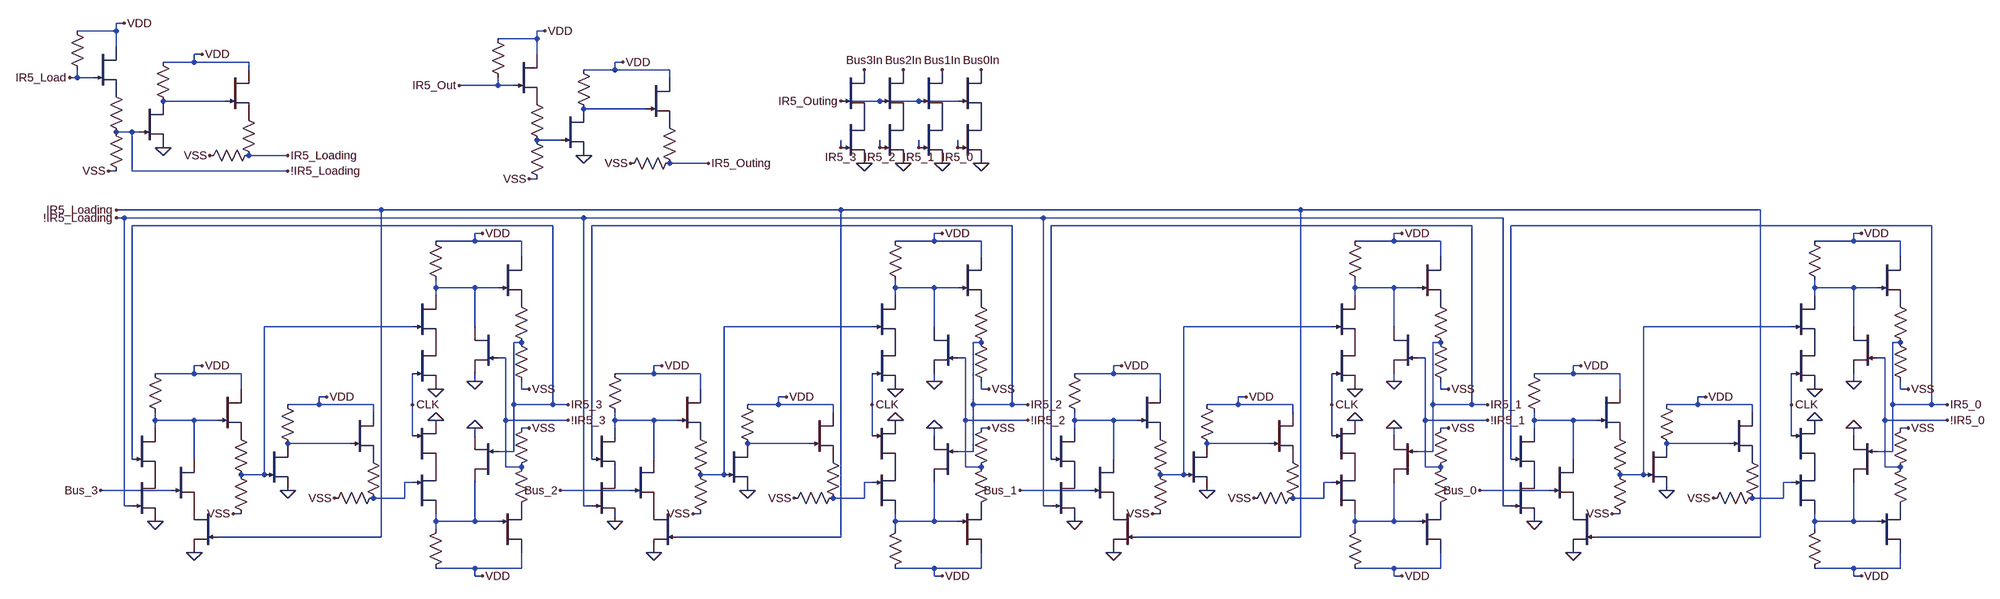
[diagram p0: schematic rv32i_ir5.asc]
rv32i_ir5.asc, the LTspice schematic file:
Version 4.1
SHEET 1 109444 42780
WIRE -5680 -1200 -5696 -1200
WIRE -5696 -1184 -5696 -1200
WIRE -5696 -1184 -5776 -1184
WIRE -4816 -1184 -4832 -1184
WIRE -4832 -1168 -4832 -1184
WIRE -4832 -1168 -4912 -1168
WIRE -5696 -1152 -5696 -1184
WIRE -5520 -1136 -5536 -1136
WIRE -4832 -1136 -4832 -1168
WIRE -5536 -1120 -5536 -1136
WIRE -5536 -1120 -5600 -1120
WIRE -5424 -1120 -5536 -1120
WIRE -4656 -1120 -4672 -1120
WIRE -5424 -1104 -5424 -1120
WIRE -4672 -1104 -4672 -1120
WIRE -4672 -1104 -4736 -1104
WIRE -4560 -1104 -4672 -1104
WIRE -5776 -1088 -5776 -1104
WIRE -5776 -1088 -5792 -1088
WIRE -5744 -1088 -5776 -1088
WIRE -4560 -1088 -4560 -1104
WIRE -4912 -1072 -4912 -1088
WIRE -4912 -1072 -4992 -1072
WIRE -4880 -1072 -4912 -1072
WIRE -5472 -1040 -5600 -1040
WIRE -4608 -1024 -4736 -1024
WIRE -5664 -976 -5696 -976
WIRE -5648 -976 -5664 -976
WIRE -4784 -960 -4832 -960
WIRE -5344 -928 -5424 -928
WIRE -4480 -912 -4560 -912
WIRE -5696 -896 -5712 -896
WIRE -5664 -896 -5664 -976
WIRE -5344 -896 -5664 -896
WIRE -4832 -880 -4848 -880
WIRE -5152 -816 -5696 -816
WIRE -5680 -800 -5696 -800
WIRE -4800 -784 -5664 -784
WIRE -4944 -768 -4960 -768
WIRE -4960 -752 -4960 -768
WIRE -4960 -752 -5040 -752
WIRE -4864 -752 -4960 -752
WIRE -4864 -720 -4864 -752
WIRE -5040 -656 -5040 -672
WIRE -4960 -656 -5040 -656
WIRE -4912 -656 -4960 -656
WIRE -5040 -640 -5040 -656
WIRE -5088 -576 -5392 -576
WIRE -4960 -576 -4960 -656
WIRE -4864 -544 -4880 -544
WIRE -4896 -512 -4912 -512
WIRE -5520 -496 -5536 -496
WIRE -5536 -480 -5536 -496
WIRE -5536 -480 -5616 -480
WIRE -5440 -480 -5536 -480
WIRE -4960 -464 -4960 -480
WIRE -5440 -448 -5440 -480
WIRE -4864 -448 -4864 -464
WIRE -4848 -448 -4864 -448
WIRE -5264 -432 -5280 -432
WIRE -5280 -416 -5280 -432
WIRE -5280 -416 -5344 -416
WIRE -5168 -416 -5280 -416
WIRE -5088 -416 -5088 -480
WIRE -4880 -416 -4880 -544
WIRE -4800 -416 -4800 -784
WIRE -4800 -416 -4880 -416
WIRE -4768 -416 -4800 -416
WIRE -5168 -400 -5168 -416
WIRE -5616 -384 -5616 -400
WIRE -5536 -384 -5616 -384
WIRE -5488 -384 -5536 -384
WIRE -4896 -384 -4896 -512
WIRE -4768 -384 -4896 -384
WIRE -5616 -368 -5616 -384
WIRE -4848 -368 -4864 -368
WIRE -5088 -352 -5088 -416
WIRE -4960 -352 -4960 -368
WIRE -5216 -336 -5344 -336
WIRE -4880 -320 -4880 -416
WIRE -4880 -320 -4912 -320
WIRE -5664 -304 -5664 -784
WIRE -5536 -304 -5536 -384
WIRE -4896 -288 -4896 -384
WIRE -4864 -288 -4896 -288
WIRE -5392 -272 -5392 -576
WIRE -5392 -272 -5440 -272
WIRE -5088 -256 -5104 -256
WIRE -5584 -240 -5728 -240
WIRE -5104 -224 -5104 -256
WIRE -5104 -224 -5168 -224
WIRE -5680 -208 -5680 -800
WIRE -5664 -208 -5680 -208
WIRE -5440 -192 -5456 -192
WIRE -5040 -176 -5040 -192
WIRE -4960 -176 -4960 -256
WIRE -4960 -176 -5040 -176
WIRE -4912 -176 -4960 -176
WIRE -5040 -160 -5040 -176
WIRE -5152 -144 -5152 -816
WIRE -5152 -144 -5488 -144
WIRE -4960 -80 -5040 -80
WIRE -4864 -80 -4864 -112
WIRE -4864 -80 -4960 -80
WIRE -4960 -64 -4960 -80
WIRE -4944 -64 -4960 -64
FLAG -5600 -944 0
FLAG -5680 -1200 VDD
FLAG -5520 -1136 VDD
FLAG -5712 -896 VSS
FLAG -5504 -928 VSS
FLAG -4736 -928 0
FLAG -4816 -1184 VDD
FLAG -4656 -1120 VDD
FLAG -4848 -880 VSS
FLAG -4640 -912 VSS
FLAG -4944 -768 VDD
FLAG -4944 -64 VDD
FLAG -4848 -368 VSS
FLAG -5040 -384 0
FLAG -5040 -448 0
FLAG -4960 -464 0
FLAG -4960 -368 0
FLAG -4848 -448 VSS
FLAG -5088 -416 CLK
FLAG -5536 -112 0
FLAG -5616 -176 0
FLAG -5344 -240 0
FLAG -5520 -496 VDD
FLAG -5264 -432 VDD
FLAG -5456 -192 VSS
FLAG -5248 -224 VSS
FLAG -5728 -240 Bus_3
FLAG -5696 -816 IR5_Loading
FLAG -5344 -928 IR5_Loading
FLAG -5344 -896 !IR5_Loading
FLAG -5696 -800 !IR5_Loading
FLAG -5792 -1088 IR5_Load
FLAG -4992 -1072 IR5_Out
FLAG -4480 -912 IR5_Outing
FLAG -4768 -384 !IR5_3
FLAG -4768 -416 IR5_3
SYMBOL res -5792 -1200 R0
WINDOW 0 -35 57 Invisible 2
WINDOW 3 34 56 Invisible 2
SYMATTR InstName R1
SYMATTR Value 100k
SYMBOL njf -5744 -1152 R0
WINDOW 0 56 32 Invisible 2
WINDOW 3 56 72 Invisible 2
SYMATTR InstName J_F1
SYMATTR Value DR
SYMBOL res -5712 -1072 R0
WINDOW 0 -24 60 Invisible 2
WINDOW 3 34 58 Invisible 2
SYMATTR InstName R2
SYMATTR Value 1k
SYMBOL res -5712 -992 R0
WINDOW 0 -22 62 Invisible 2
WINDOW 3 37 62 Invisible 2
SYMATTR InstName R3
SYMATTR Value 4.8k
SYMBOL njf -5648 -1040 R0
WINDOW 0 56 32 Invisible 2
WINDOW 3 56 72 Invisible 2
SYMATTR InstName J_A1
SYMATTR Value DR
SYMBOL res -5616 -1136 R0
WINDOW 0 56 32 Invisible 2
WINDOW 3 56 72 Invisible 2
SYMATTR InstName R4
SYMATTR Value 50k
SYMBOL njf -5472 -1104 R0
WINDOW 0 56 32 Invisible 2
WINDOW 3 56 72 Invisible 2
SYMATTR InstName J_A2
SYMATTR Value DR
SYMBOL res -5440 -1024 R0
WINDOW 0 37 24 Invisible 2
WINDOW 3 -30 25 Invisible 2
SYMATTR InstName R5
SYMATTR Value 1k
SYMBOL res -5408 -944 R90
WINDOW 0 59 66 Invisible 2
WINDOW 3 34 13 Invisible 2
SYMATTR InstName R6
SYMATTR Value 4.5k
SYMBOL res -4928 -1184 R0
WINDOW 0 -35 57 Invisible 2
WINDOW 3 34 56 Invisible 2
SYMATTR InstName R7
SYMATTR Value 100k
SYMBOL njf -4880 -1136 R0
WINDOW 0 56 32 Invisible 2
WINDOW 3 56 72 Invisible 2
SYMATTR InstName J_F2
SYMATTR Value DR
SYMBOL res -4848 -1056 R0
WINDOW 0 -24 60 Invisible 2
WINDOW 3 34 58 Invisible 2
SYMATTR InstName R8
SYMATTR Value 1k
SYMBOL res -4848 -976 R0
WINDOW 0 -22 62 Invisible 2
WINDOW 3 37 62 Invisible 2
SYMATTR InstName R9
SYMATTR Value 4.8k
SYMBOL njf -4784 -1024 R0
WINDOW 0 56 32 Invisible 2
WINDOW 3 56 72 Invisible 2
SYMATTR InstName J_A3
SYMATTR Value DR
SYMBOL res -4752 -1120 R0
WINDOW 0 56 32 Invisible 2
WINDOW 3 56 72 Invisible 2
SYMATTR InstName R10
SYMATTR Value 50k
SYMBOL njf -4608 -1088 R0
WINDOW 0 56 32 Invisible 2
WINDOW 3 56 72 Invisible 2
SYMATTR InstName J_A4
SYMATTR Value DR
SYMBOL res -4576 -1008 R0
WINDOW 0 37 24 Invisible 2
WINDOW 3 -30 25 Invisible 2
SYMATTR InstName R11
SYMATTR Value 1k
SYMBOL res -4544 -928 R90
WINDOW 0 59 66 Invisible 2
WINDOW 3 34 13 Invisible 2
SYMATTR InstName R12
SYMATTR Value 4.5k
SYMBOL njf -5088 -640 R0
WINDOW 0 56 32 Invisible 2
WINDOW 3 56 72 Invisible 2
SYMATTR InstName J_A5
SYMATTR Value DR
SYMBOL res -5056 -768 R0
WINDOW 0 -35 57 Invisible 2
WINDOW 3 34 56 Invisible 2
SYMATTR InstName R13
SYMATTR Value 100k
SYMBOL njf -4912 -720 R0
WINDOW 0 56 32 Invisible 2
WINDOW 3 56 72 Invisible 2
SYMATTR InstName J_F3
SYMATTR Value DR
SYMBOL res -4880 -640 R0
WINDOW 0 -24 60 Invisible 2
WINDOW 3 34 58 Invisible 2
SYMATTR InstName R14
SYMATTR Value 1k
SYMBOL res -4880 -560 R0
WINDOW 0 -22 62 Invisible 2
WINDOW 3 37 62 Invisible 2
SYMATTR InstName R15
SYMATTR Value 4.8k
SYMBOL njf -4912 -576 M0
WINDOW 0 11 -7 Invisible 2
WINDOW 3 56 72 Invisible 2
SYMATTR InstName J_B1
SYMATTR Value DR
SYMBOL njf -5088 -192 M180
WINDOW 0 56 32 Invisible 2
WINDOW 3 56 72 Invisible 2
SYMATTR InstName J_A6
SYMATTR Value DR
SYMBOL res -5056 -64 M180
WINDOW 0 36 76 Invisible 2
WINDOW 3 36 40 Invisible 2
SYMATTR InstName R16
SYMATTR Value 100k
SYMBOL njf -4912 -112 M180
WINDOW 0 56 32 Invisible 2
WINDOW 3 56 72 Invisible 2
SYMATTR InstName J_F4
SYMATTR Value DR
SYMBOL res -4880 -192 M180
WINDOW 0 36 76 Invisible 2
WINDOW 3 36 40 Invisible 2
SYMATTR InstName R17
SYMATTR Value 1k
SYMBOL res -4880 -272 M180
WINDOW 0 36 76 Invisible 2
WINDOW 3 36 40 Invisible 2
SYMATTR InstName R18
SYMATTR Value 4.8k
SYMBOL njf -4912 -256 R180
WINDOW 0 56 32 Invisible 2
WINDOW 3 56 72 Invisible 2
SYMATTR InstName J_B2
SYMATTR Value DR
SYMBOL njf -5088 -544 R0
WINDOW 0 56 32 Invisible 2
WINDOW 3 56 72 Invisible 2
SYMATTR InstName J_A7
SYMATTR Value DR
SYMBOL njf -5088 -288 M180
WINDOW 0 56 32 Invisible 2
WINDOW 3 56 72 Invisible 2
SYMATTR InstName J_A8
SYMATTR Value DR
SYMBOL njf -5664 -368 R0
WINDOW 0 56 32 Invisible 2
WINDOW 3 56 72 Invisible 2
SYMATTR InstName J_A9
SYMATTR Value DR
SYMBOL res -5632 -496 R0
WINDOW 0 -35 57 Invisible 2
WINDOW 3 34 56 Invisible 2
SYMATTR InstName R19
SYMATTR Value 100k
SYMBOL njf -5488 -448 R0
WINDOW 0 56 32 Invisible 2
WINDOW 3 56 72 Invisible 2
SYMATTR InstName J_F5
SYMATTR Value DR
SYMBOL res -5456 -368 R0
WINDOW 0 -24 60 Invisible 2
WINDOW 3 34 58 Invisible 2
SYMATTR InstName R20
SYMATTR Value 1k
SYMBOL res -5456 -288 R0
WINDOW 0 -22 62 Invisible 2
WINDOW 3 37 62 Invisible 2
SYMATTR InstName R21
SYMATTR Value 4.8k
SYMBOL njf -5584 -304 R0
WINDOW 0 56 32 Invisible 2
WINDOW 3 56 72 Invisible 2
SYMATTR InstName J_B3
SYMATTR Value DR
SYMBOL njf -5392 -336 R0
WINDOW 0 56 32 Invisible 2
WINDOW 3 56 72 Invisible 2
SYMATTR InstName J_A10
SYMATTR Value DR
SYMBOL res -5360 -432 R0
WINDOW 0 56 32 Invisible 2
WINDOW 3 56 72 Invisible 2
SYMATTR InstName R22
SYMATTR Value 50k
SYMBOL njf -5216 -400 R0
WINDOW 0 56 32 Invisible 2
WINDOW 3 56 72 Invisible 2
SYMATTR InstName J_A11
SYMATTR Value DR
SYMBOL res -5184 -320 R0
WINDOW 0 37 24 Invisible 2
WINDOW 3 -30 25 Invisible 2
SYMATTR InstName R23
SYMATTR Value 1k
SYMBOL res -5152 -240 R90
WINDOW 0 59 66 Invisible 2
WINDOW 3 34 13 Invisible 2
SYMATTR InstName R24
SYMATTR Value 4.5k
SYMBOL njf -5664 -272 R0
WINDOW 0 56 32 Invisible 2
WINDOW 3 56 72 Invisible 2
SYMATTR InstName J_A12
SYMATTR Value DR
SYMBOL njf -5488 -208 M0
WINDOW 0 56 32 Invisible 2
WINDOW 3 56 72 Invisible 2
SYMATTR InstName J_B4
SYMATTR Value DR
WIRE -4208 -816 -5152 -816
WIRE -4736 -800 -5680 -800
WIRE -3856 -784 -4720 -784
WIRE -4000 -768 -4016 -768
WIRE -4016 -752 -4016 -768
WIRE -4016 -752 -4096 -752
WIRE -3920 -752 -4016 -752
WIRE -3920 -720 -3920 -752
WIRE -4096 -656 -4096 -672
WIRE -4016 -656 -4096 -656
WIRE -3968 -656 -4016 -656
WIRE -4096 -640 -4096 -656
WIRE -4144 -576 -4448 -576
WIRE -4016 -576 -4016 -656
WIRE -3920 -544 -3936 -544
WIRE -3952 -512 -3968 -512
WIRE -4576 -496 -4592 -496
WIRE -4592 -480 -4592 -496
WIRE -4592 -480 -4672 -480
WIRE -4496 -480 -4592 -480
WIRE -4016 -464 -4016 -480
WIRE -4496 -448 -4496 -480
WIRE -3920 -448 -3920 -464
WIRE -3904 -448 -3920 -448
WIRE -4320 -432 -4336 -432
WIRE -4336 -416 -4336 -432
WIRE -4336 -416 -4400 -416
WIRE -4224 -416 -4336 -416
WIRE -4144 -416 -4144 -480
WIRE -3936 -416 -3936 -544
WIRE -3856 -416 -3856 -784
WIRE -3856 -416 -3936 -416
WIRE -3824 -416 -3856 -416
WIRE -4224 -400 -4224 -416
WIRE -4672 -384 -4672 -400
WIRE -4592 -384 -4672 -384
WIRE -4544 -384 -4592 -384
WIRE -3952 -384 -3952 -512
WIRE -3824 -384 -3952 -384
WIRE -4672 -368 -4672 -384
WIRE -3904 -368 -3920 -368
WIRE -4144 -352 -4144 -416
WIRE -4016 -352 -4016 -368
WIRE -4272 -336 -4400 -336
WIRE -3936 -320 -3936 -416
WIRE -3936 -320 -3968 -320
WIRE -4720 -304 -4720 -784
WIRE -4592 -304 -4592 -384
WIRE -3952 -288 -3952 -384
WIRE -3920 -288 -3952 -288
WIRE -4448 -272 -4448 -576
WIRE -4448 -272 -4496 -272
WIRE -4144 -256 -4160 -256
WIRE -4640 -240 -4784 -240
WIRE -4160 -224 -4160 -256
WIRE -4160 -224 -4224 -224
WIRE -4736 -208 -4736 -800
WIRE -4720 -208 -4736 -208
WIRE -4496 -192 -4512 -192
WIRE -4096 -176 -4096 -192
WIRE -4016 -176 -4016 -256
WIRE -4016 -176 -4096 -176
WIRE -3968 -176 -4016 -176
WIRE -4096 -160 -4096 -176
WIRE -4208 -144 -4208 -816
WIRE -4208 -144 -4544 -144
WIRE -4016 -80 -4096 -80
WIRE -3920 -80 -3920 -112
WIRE -3920 -80 -4016 -80
WIRE -4016 -64 -4016 -80
WIRE -4000 -64 -4016 -64
FLAG -4000 -768 VDD
FLAG -4000 -64 VDD
FLAG -3904 -368 VSS
FLAG -4096 -384 0
FLAG -4096 -448 0
FLAG -4016 -464 0
FLAG -4016 -368 0
FLAG -3904 -448 VSS
FLAG -4144 -416 CLK
FLAG -4592 -112 0
FLAG -4672 -176 0
FLAG -4400 -240 0
FLAG -4576 -496 VDD
FLAG -4320 -432 VDD
FLAG -4512 -192 VSS
FLAG -4304 -224 VSS
FLAG -4784 -240 Bus_2
FLAG -3824 -416 IR5_2
FLAG -3824 -384 !IR5_2
SYMBOL njf -4144 -640 R0
WINDOW 0 56 32 Invisible 2
WINDOW 3 56 72 Invisible 2
SYMATTR InstName J_A13
SYMATTR Value DR
SYMBOL res -4112 -768 R0
WINDOW 0 -35 57 Invisible 2
WINDOW 3 34 56 Invisible 2
SYMATTR InstName R25
SYMATTR Value 100k
SYMBOL njf -3968 -720 R0
WINDOW 0 56 32 Invisible 2
WINDOW 3 56 72 Invisible 2
SYMATTR InstName J_F6
SYMATTR Value DR
SYMBOL res -3936 -640 R0
WINDOW 0 -24 60 Invisible 2
WINDOW 3 34 58 Invisible 2
SYMATTR InstName R26
SYMATTR Value 1k
SYMBOL res -3936 -560 R0
WINDOW 0 -22 62 Invisible 2
WINDOW 3 37 62 Invisible 2
SYMATTR InstName R27
SYMATTR Value 4.8k
SYMBOL njf -3968 -576 M0
WINDOW 0 11 -7 Invisible 2
WINDOW 3 56 72 Invisible 2
SYMATTR InstName J_B5
SYMATTR Value DR
SYMBOL njf -4144 -192 M180
WINDOW 0 56 32 Invisible 2
WINDOW 3 56 72 Invisible 2
SYMATTR InstName J_A14
SYMATTR Value DR
SYMBOL res -4112 -64 M180
WINDOW 0 36 76 Invisible 2
WINDOW 3 36 40 Invisible 2
SYMATTR InstName R28
SYMATTR Value 100k
SYMBOL njf -3968 -112 M180
WINDOW 0 56 32 Invisible 2
WINDOW 3 56 72 Invisible 2
SYMATTR InstName J_F7
SYMATTR Value DR
SYMBOL res -3936 -192 M180
WINDOW 0 36 76 Invisible 2
WINDOW 3 36 40 Invisible 2
SYMATTR InstName R29
SYMATTR Value 1k
SYMBOL res -3936 -272 M180
WINDOW 0 36 76 Invisible 2
WINDOW 3 36 40 Invisible 2
SYMATTR InstName R30
SYMATTR Value 4.8k
SYMBOL njf -3968 -256 R180
WINDOW 0 56 32 Invisible 2
WINDOW 3 56 72 Invisible 2
SYMATTR InstName J_B6
SYMATTR Value DR
SYMBOL njf -4144 -544 R0
WINDOW 0 56 32 Invisible 2
WINDOW 3 56 72 Invisible 2
SYMATTR InstName J_A15
SYMATTR Value DR
SYMBOL njf -4144 -288 M180
WINDOW 0 56 32 Invisible 2
WINDOW 3 56 72 Invisible 2
SYMATTR InstName J_A16
SYMATTR Value DR
SYMBOL njf -4720 -368 R0
WINDOW 0 56 32 Invisible 2
WINDOW 3 56 72 Invisible 2
SYMATTR InstName J_A17
SYMATTR Value DR
SYMBOL res -4688 -496 R0
WINDOW 0 -35 57 Invisible 2
WINDOW 3 34 56 Invisible 2
SYMATTR InstName R31
SYMATTR Value 100k
SYMBOL njf -4544 -448 R0
WINDOW 0 56 32 Invisible 2
WINDOW 3 56 72 Invisible 2
SYMATTR InstName J_F8
SYMATTR Value DR
SYMBOL res -4512 -368 R0
WINDOW 0 -24 60 Invisible 2
WINDOW 3 34 58 Invisible 2
SYMATTR InstName R32
SYMATTR Value 1k
SYMBOL res -4512 -288 R0
WINDOW 0 -22 62 Invisible 2
WINDOW 3 37 62 Invisible 2
SYMATTR InstName R33
SYMATTR Value 4.8k
SYMBOL njf -4640 -304 R0
WINDOW 0 56 32 Invisible 2
WINDOW 3 56 72 Invisible 2
SYMATTR InstName J_B7
SYMATTR Value DR
SYMBOL njf -4448 -336 R0
WINDOW 0 56 32 Invisible 2
WINDOW 3 56 72 Invisible 2
SYMATTR InstName J_A18
SYMATTR Value DR
SYMBOL res -4416 -432 R0
WINDOW 0 56 32 Invisible 2
WINDOW 3 56 72 Invisible 2
SYMATTR InstName R34
SYMATTR Value 50k
SYMBOL njf -4272 -400 R0
WINDOW 0 56 32 Invisible 2
WINDOW 3 56 72 Invisible 2
SYMATTR InstName J_A19
SYMATTR Value DR
SYMBOL res -4240 -320 R0
WINDOW 0 37 24 Invisible 2
WINDOW 3 -30 25 Invisible 2
SYMATTR InstName R35
SYMATTR Value 1k
SYMBOL res -4208 -240 R90
WINDOW 0 59 66 Invisible 2
WINDOW 3 34 13 Invisible 2
SYMATTR InstName R36
SYMATTR Value 4.5k
SYMBOL njf -4720 -272 R0
WINDOW 0 56 32 Invisible 2
WINDOW 3 56 72 Invisible 2
SYMATTR InstName J_A20
SYMATTR Value DR
SYMBOL njf -4544 -208 M0
WINDOW 0 56 32 Invisible 2
WINDOW 3 56 72 Invisible 2
SYMATTR InstName J_B8
SYMATTR Value DR
WIRE -3264 -816 -4208 -816
WIRE -3792 -800 -4736 -800
WIRE -2912 -784 -3776 -784
WIRE -3056 -768 -3072 -768
WIRE -3072 -752 -3072 -768
WIRE -3072 -752 -3152 -752
WIRE -2976 -752 -3072 -752
WIRE -2976 -720 -2976 -752
WIRE -3152 -656 -3152 -672
WIRE -3072 -656 -3152 -656
WIRE -3024 -656 -3072 -656
WIRE -3152 -640 -3152 -656
WIRE -3200 -576 -3504 -576
WIRE -3072 -576 -3072 -656
WIRE -2976 -544 -2992 -544
WIRE -3008 -512 -3024 -512
WIRE -3632 -496 -3648 -496
WIRE -3648 -480 -3648 -496
WIRE -3648 -480 -3728 -480
WIRE -3552 -480 -3648 -480
WIRE -3072 -464 -3072 -480
WIRE -3552 -448 -3552 -480
WIRE -2976 -448 -2976 -464
WIRE -2960 -448 -2976 -448
WIRE -3376 -432 -3392 -432
WIRE -3392 -416 -3392 -432
WIRE -3392 -416 -3456 -416
WIRE -3280 -416 -3392 -416
WIRE -3200 -416 -3200 -480
WIRE -2992 -416 -2992 -544
WIRE -2912 -416 -2912 -784
WIRE -2912 -416 -2992 -416
WIRE -2880 -416 -2912 -416
WIRE -3280 -400 -3280 -416
WIRE -3728 -384 -3728 -400
WIRE -3648 -384 -3728 -384
WIRE -3600 -384 -3648 -384
WIRE -3008 -384 -3008 -512
WIRE -2880 -384 -3008 -384
WIRE -3728 -368 -3728 -384
WIRE -2960 -368 -2976 -368
WIRE -3200 -352 -3200 -416
WIRE -3072 -352 -3072 -368
WIRE -3328 -336 -3456 -336
WIRE -2992 -320 -2992 -416
WIRE -2992 -320 -3024 -320
WIRE -3776 -304 -3776 -784
WIRE -3648 -304 -3648 -384
WIRE -3008 -288 -3008 -384
WIRE -2976 -288 -3008 -288
WIRE -3504 -272 -3504 -576
WIRE -3504 -272 -3552 -272
WIRE -3200 -256 -3216 -256
WIRE -3696 -240 -3840 -240
WIRE -3216 -224 -3216 -256
WIRE -3216 -224 -3280 -224
WIRE -3792 -208 -3792 -800
WIRE -3776 -208 -3792 -208
WIRE -3552 -192 -3568 -192
WIRE -3152 -176 -3152 -192
WIRE -3072 -176 -3072 -256
WIRE -3072 -176 -3152 -176
WIRE -3024 -176 -3072 -176
WIRE -3152 -160 -3152 -176
WIRE -3264 -144 -3264 -816
WIRE -3264 -144 -3600 -144
WIRE -3072 -80 -3152 -80
WIRE -2976 -80 -2976 -112
WIRE -2976 -80 -3072 -80
WIRE -3072 -64 -3072 -80
WIRE -3056 -64 -3072 -64
FLAG -3056 -768 VDD
FLAG -3056 -64 VDD
FLAG -2960 -368 VSS
FLAG -3152 -384 0
FLAG -3152 -448 0
FLAG -3072 -464 0
FLAG -3072 -368 0
FLAG -2960 -448 VSS
FLAG -3200 -416 CLK
FLAG -3648 -112 0
FLAG -3728 -176 0
FLAG -3456 -240 0
FLAG -3632 -496 VDD
FLAG -3376 -432 VDD
FLAG -3568 -192 VSS
FLAG -3360 -224 VSS
FLAG -3840 -240 Bus_1
FLAG -2880 -416 IR5_1
FLAG -2880 -384 !IR5_1
SYMBOL njf -3200 -640 R0
WINDOW 0 56 32 Invisible 2
WINDOW 3 56 72 Invisible 2
SYMATTR InstName J_A21
SYMATTR Value DR
SYMBOL res -3168 -768 R0
WINDOW 0 -35 57 Invisible 2
WINDOW 3 34 56 Invisible 2
SYMATTR InstName R37
SYMATTR Value 100k
SYMBOL njf -3024 -720 R0
WINDOW 0 56 32 Invisible 2
WINDOW 3 56 72 Invisible 2
SYMATTR InstName J_F9
SYMATTR Value DR
SYMBOL res -2992 -640 R0
WINDOW 0 -24 60 Invisible 2
WINDOW 3 34 58 Invisible 2
SYMATTR InstName R38
SYMATTR Value 1k
SYMBOL res -2992 -560 R0
WINDOW 0 -22 62 Invisible 2
WINDOW 3 37 62 Invisible 2
SYMATTR InstName R39
SYMATTR Value 4.8k
SYMBOL njf -3024 -576 M0
WINDOW 0 11 -7 Invisible 2
WINDOW 3 56 72 Invisible 2
SYMATTR InstName J_B9
SYMATTR Value DR
SYMBOL njf -3200 -192 M180
WINDOW 0 56 32 Invisible 2
WINDOW 3 56 72 Invisible 2
SYMATTR InstName J_A22
SYMATTR Value DR
SYMBOL res -3168 -64 M180
WINDOW 0 36 76 Invisible 2
WINDOW 3 36 40 Invisible 2
SYMATTR InstName R40
SYMATTR Value 100k
SYMBOL njf -3024 -112 M180
WINDOW 0 56 32 Invisible 2
WINDOW 3 56 72 Invisible 2
SYMATTR InstName J_F10
SYMATTR Value DR
SYMBOL res -2992 -192 M180
WINDOW 0 36 76 Invisible 2
WINDOW 3 36 40 Invisible 2
SYMATTR InstName R41
SYMATTR Value 1k
SYMBOL res -2992 -272 M180
WINDOW 0 36 76 Invisible 2
WINDOW 3 36 40 Invisible 2
SYMATTR InstName R42
SYMATTR Value 4.8k
SYMBOL njf -3024 -256 R180
WINDOW 0 56 32 Invisible 2
WINDOW 3 56 72 Invisible 2
SYMATTR InstName J_B10
SYMATTR Value DR
SYMBOL njf -3200 -544 R0
WINDOW 0 56 32 Invisible 2
WINDOW 3 56 72 Invisible 2
SYMATTR InstName J_A23
SYMATTR Value DR
SYMBOL njf -3200 -288 M180
WINDOW 0 56 32 Invisible 2
WINDOW 3 56 72 Invisible 2
SYMATTR InstName J_A24
SYMATTR Value DR
SYMBOL njf -3776 -368 R0
WINDOW 0 56 32 Invisible 2
WINDOW 3 56 72 Invisible 2
SYMATTR InstName J_A25
SYMATTR Value DR
SYMBOL res -3744 -496 R0
WINDOW 0 -35 57 Invisible 2
WINDOW 3 34 56 Invisible 2
SYMATTR InstName R43
SYMATTR Value 100k
SYMBOL njf -3600 -448 R0
WINDOW 0 56 32 Invisible 2
WINDOW 3 56 72 Invisible 2
SYMATTR InstName J_F11
SYMATTR Value DR
SYMBOL res -3568 -368 R0
WINDOW 0 -24 60 Invisible 2
WINDOW 3 34 58 Invisible 2
SYMATTR InstName R44
SYMATTR Value 1k
SYMBOL res -3568 -288 R0
WINDOW 0 -22 62 Invisible 2
WINDOW 3 37 62 Invisible 2
SYMATTR InstName R45
SYMATTR Value 4.8k
SYMBOL njf -3696 -304 R0
WINDOW 0 56 32 Invisible 2
WINDOW 3 56 72 Invisible 2
SYMATTR InstName J_B11
SYMATTR Value DR
SYMBOL njf -3504 -336 R0
WINDOW 0 56 32 Invisible 2
WINDOW 3 56 72 Invisible 2
SYMATTR InstName J_A26
SYMATTR Value DR
SYMBOL res -3472 -432 R0
WINDOW 0 56 32 Invisible 2
WINDOW 3 56 72 Invisible 2
SYMATTR InstName R46
SYMATTR Value 50k
SYMBOL njf -3328 -400 R0
WINDOW 0 56 32 Invisible 2
WINDOW 3 56 72 Invisible 2
SYMATTR InstName J_A27
SYMATTR Value DR
SYMBOL res -3296 -320 R0
WINDOW 0 37 24 Invisible 2
WINDOW 3 -30 25 Invisible 2
SYMATTR InstName R47
SYMATTR Value 1k
SYMBOL res -3264 -240 R90
WINDOW 0 59 66 Invisible 2
WINDOW 3 34 13 Invisible 2
SYMATTR InstName R48
SYMATTR Value 4.5k
SYMBOL njf -3776 -272 R0
WINDOW 0 56 32 Invisible 2
WINDOW 3 56 72 Invisible 2
SYMATTR InstName J_A28
SYMATTR Value DR
SYMBOL njf -3600 -208 M0
WINDOW 0 56 32 Invisible 2
WINDOW 3 56 72 Invisible 2
SYMATTR InstName J_B12
SYMATTR Value DR
WIRE -2320 -816 -3264 -816
WIRE -2848 -800 -3792 -800
WIRE -1968 -784 -2832 -784
WIRE -2112 -768 -2128 -768
WIRE -2128 -752 -2128 -768
WIRE -2128 -752 -2208 -752
WIRE -2032 -752 -2128 -752
WIRE -2032 -720 -2032 -752
WIRE -2208 -656 -2208 -672
WIRE -2128 -656 -2208 -656
WIRE -2080 -656 -2128 -656
WIRE -2208 -640 -2208 -656
WIRE -2256 -576 -2560 -576
WIRE -2128 -576 -2128 -656
WIRE -2032 -544 -2048 -544
WIRE -2064 -512 -2080 -512
WIRE -2688 -496 -2704 -496
WIRE -2704 -480 -2704 -496
WIRE -2704 -480 -2784 -480
WIRE -2608 -480 -2704 -480
WIRE -2128 -464 -2128 -480
WIRE -2608 -448 -2608 -480
WIRE -2032 -448 -2032 -464
WIRE -2016 -448 -2032 -448
WIRE -2432 -432 -2448 -432
WIRE -2448 -416 -2448 -432
WIRE -2448 -416 -2512 -416
WIRE -2336 -416 -2448 -416
WIRE -2256 -416 -2256 -480
WIRE -2048 -416 -2048 -544
WIRE -1968 -416 -1968 -784
WIRE -1968 -416 -2048 -416
WIRE -1936 -416 -1968 -416
WIRE -2336 -400 -2336 -416
WIRE -2784 -384 -2784 -400
WIRE -2704 -384 -2784 -384
WIRE -2656 -384 -2704 -384
WIRE -2064 -384 -2064 -512
WIRE -1936 -384 -2064 -384
WIRE -2784 -368 -2784 -384
WIRE -2016 -368 -2032 -368
WIRE -2256 -352 -2256 -416
WIRE -2128 -352 -2128 -368
WIRE -2384 -336 -2512 -336
WIRE -2048 -320 -2048 -416
WIRE -2048 -320 -2080 -320
WIRE -2832 -304 -2832 -784
WIRE -2704 -304 -2704 -384
WIRE -2064 -288 -2064 -384
WIRE -2032 -288 -2064 -288
WIRE -2560 -272 -2560 -576
WIRE -2560 -272 -2608 -272
WIRE -2256 -256 -2272 -256
WIRE -2752 -240 -2896 -240
WIRE -2272 -224 -2272 -256
WIRE -2272 -224 -2336 -224
WIRE -2848 -208 -2848 -800
WIRE -2832 -208 -2848 -208
WIRE -2608 -192 -2624 -192
WIRE -2208 -176 -2208 -192
WIRE -2128 -176 -2128 -256
WIRE -2128 -176 -2208 -176
WIRE -2080 -176 -2128 -176
WIRE -2208 -160 -2208 -176
WIRE -2320 -144 -2320 -816
WIRE -2320 -144 -2656 -144
WIRE -2128 -80 -2208 -80
WIRE -2032 -80 -2032 -112
WIRE -2032 -80 -2128 -80
WIRE -2128 -64 -2128 -80
WIRE -2112 -64 -2128 -64
FLAG -2112 -768 VDD
FLAG -2112 -64 VDD
FLAG -2016 -368 VSS
FLAG -2208 -384 0
FLAG -2208 -448 0
FLAG -2128 -464 0
FLAG -2128 -368 0
FLAG -2016 -448 VSS
FLAG -2256 -416 CLK
FLAG -2704 -112 0
FLAG -2784 -176 0
FLAG -2512 -240 0
FLAG -2688 -496 VDD
FLAG -2432 -432 VDD
FLAG -2624 -192 VSS
FLAG -2416 -224 VSS
FLAG -2896 -240 Bus_0
FLAG -1936 -416 IR5_0
FLAG -1936 -384 !IR5_0
SYMBOL njf -2256 -640 R0
WINDOW 0 56 32 Invisible 2
WINDOW 3 56 72 Invisible 2
SYMATTR InstName J_A29
SYMATTR Value DR
SYMBOL res -2224 -768 R0
WINDOW 0 -35 57 Invisible 2
WINDOW 3 34 56 Invisible 2
SYMATTR InstName R49
SYMATTR Value 100k
SYMBOL njf -2080 -720 R0
WINDOW 0 56 32 Invisible 2
WINDOW 3 56 72 Invisible 2
SYMATTR InstName J_F12
SYMATTR Value DR
SYMBOL res -2048 -640 R0
WINDOW 0 -24 60 Invisible 2
WINDOW 3 34 58 Invisible 2
SYMATTR InstName R50
SYMATTR Value 1k
SYMBOL res -2048 -560 R0
WINDOW 0 -22 62 Invisible 2
WINDOW 3 37 62 Invisible 2
SYMATTR InstName R51
SYMATTR Value 4.8k
SYMBOL njf -2080 -576 M0
WINDOW 0 11 -7 Invisible 2
WINDOW 3 56 72 Invisible 2
SYMATTR InstName J_B13
SYMATTR Value DR
SYMBOL njf -2256 -192 M180
WINDOW 0 56 32 Invisible 2
WINDOW 3 56 72 Invisible 2
SYMATTR InstName J_A30
SYMATTR Value DR
SYMBOL res -2224 -64 M180
WINDOW 0 36 76 Invisible 2
WINDOW 3 36 40 Invisible 2
SYMATTR InstName R52
SYMATTR Value 100k
SYMBOL njf -2080 -112 M180
WINDOW 0 56 32 Invisible 2
WINDOW 3 56 72 Invisible 2
SYMATTR InstName J_F13
SYMATTR Value DR
SYMBOL res -2048 -192 M180
WINDOW 0 36 76 Invisible 2
WINDOW 3 36 40 Invisible 2
SYMATTR InstName R53
SYMATTR Value 1k
SYMBOL res -2048 -272 M180
WINDOW 0 36 76 Invisible 2
WINDOW 3 36 40 Invisible 2
SYMATTR InstName R54
SYMATTR Value 4.8k
SYMBOL njf -2080 -256 R180
WINDOW 0 56 32 Invisible 2
WINDOW 3 56 72 Invisible 2
SYMATTR InstName J_B14
SYMATTR Value DR
SYMBOL njf -2256 -544 R0
WINDOW 0 56 32 Invisible 2
WINDOW 3 56 72 Invisible 2
SYMATTR InstName J_A31
SYMATTR Value DR
SYMBOL njf -2256 -288 M180
WINDOW 0 56 32 Invisible 2
WINDOW 3 56 72 Invisible 2
SYMATTR InstName J_A32
SYMATTR Value DR
SYMBOL njf -2832 -368 R0
WINDOW 0 56 32 Invisible 2
WINDOW 3 56 72 Invisible 2
SYMATTR InstName J_A33
SYMATTR Value DR
SYMBOL res -2800 -496 R0
WINDOW 0 -35 57 Invisible 2
WINDOW 3 34 56 Invisible 2
SYMATTR InstName R55
SYMATTR Value 100k
SYMBOL njf -2656 -448 R0
WINDOW 0 56 32 Invisible 2
WINDOW 3 56 72 Invisible 2
SYMATTR InstName J_F14
SYMATTR Value DR
SYMBOL res -2624 -368 R0
WINDOW 0 -24 60 Invisible 2
WINDOW 3 34 58 Invisible 2
SYMATTR InstName R56
SYMATTR Value 1k
SYMBOL res -2624 -288 R0
WINDOW 0 -22 62 Invisible 2
WINDOW 3 37 62 Invisible 2
SYMATTR InstName R57
SYMATTR Value 4.8k
SYMBOL njf -2752 -304 R0
WINDOW 0 56 32 Invisible 2
WINDOW 3 56 72 Invisible 2
SYMATTR InstName J_B15
SYMATTR Value DR
SYMBOL njf -2560 -336 R0
WINDOW 0 56 32 Invisible 2
WINDOW 3 56 72 Invisible 2
SYMATTR InstName J_A34
SYMATTR Value DR
SYMBOL res -2528 -432 R0
WINDOW 0 56 32 Invisible 2
WINDOW 3 56 72 Invisible 2
SYMATTR InstName R58
SYMATTR Value 50k
SYMBOL njf -2384 -400 R0
WINDOW 0 56 32 Invisible 2
WINDOW 3 56 72 Invisible 2
SYMATTR InstName J_A35
SYMATTR Value DR
SYMBOL res -2352 -320 R0
WINDOW 0 37 24 Invisible 2
WINDOW 3 -30 25 Invisible 2
SYMATTR InstName R59
SYMATTR Value 1k
SYMBOL res -2320 -240 R90
WINDOW 0 59 66 Invisible 2
WINDOW 3 34 13 Invisible 2
SYMATTR InstName R60
SYMATTR Value 4.5k
SYMBOL njf -2832 -272 R0
WINDOW 0 56 32 Invisible 2
WINDOW 3 56 72 Invisible 2
SYMATTR InstName J_A36
SYMATTR Value DR
SYMBOL njf -2656 -208 M0
WINDOW 0 56 32 Invisible 2
WINDOW 3 56 72 Invisible 2
SYMATTR InstName J_B16
SYMATTR Value DR
WIRE -4128 -1040 -4208 -1040
WIRE -4048 -1040 -4128 -1040
WIRE -3968 -1040 -4048 -1040
FLAG -4208 -1040 IR5_Outing
WIRE -4208 -944 -4208 -960
FLAG -4160 -912 0
FLAG -4160 -1104 Bus3In
FLAG -4208 -944 IR5_3
SYMBOL njf -4208 -1008 R0
WINDOW 0 56 32 Invisible 2
WINDOW 3 56 72 Invisible 2
SYMATTR InstName J_BUS1
SYMATTR Value DR
SYMBOL njf -4208 -1104 R0
WINDOW 0 56 32 Invisible 2
WINDOW 3 56 72 Invisible 2
SYMATTR InstName J_BUS2
SYMATTR Value DR
WIRE -4128 -944 -4128 -960
FLAG -4080 -912 0
FLAG -4080 -1104 Bus2In
FLAG -4128 -944 IR5_2
SYMBOL njf -4128 -1008 R0
WINDOW 0 56 32 Invisible 2
WINDOW 3 56 72 Invisible 2
SYMATTR InstName J_BUS3
SYMATTR Value DR
SYMBOL njf -4128 -1104 R0
WINDOW 0 56 32 Invisible 2
WINDOW 3 56 72 Invisible 2
SYMATTR InstName J_BUS4
SYMATTR Value DR
WIRE -4048 -944 -4048 -960
FLAG -4000 -912 0
FLAG -4000 -1104 Bus1In
FLAG -4048 -944 IR5_1
SYMBOL njf -4048 -1008 R0
WINDOW 0 56 32 Invisible 2
WINDOW 3 56 72 Invisible 2
SYMATTR InstName J_BUS5
SYMATTR Value DR
SYMBOL njf -4048 -1104 R0
WINDOW 0 56 32 Invisible 2
WINDOW 3 56 72 Invisible 2
SYMATTR InstName J_BUS6
SYMATTR Value DR
WIRE -3968 -944 -3968 -960
FLAG -3920 -912 0
FLAG -3920 -1104 Bus0In
FLAG -3968 -944 IR5_0
SYMBOL njf -3968 -1008 R0
WINDOW 0 56 32 Invisible 2
WINDOW 3 56 72 Invisible 2
SYMATTR InstName J_BUS7
SYMATTR Value DR
SYMBOL njf -3968 -1104 R0
WINDOW 0 56 32 Invisible 2
WINDOW 3 56 72 Invisible 2
SYMATTR InstName J_BUS8
SYMATTR Value DR

The netlist it stands for:
* rv32i_ir5.asc
R1 VDD IR5_Load 100k
J_F1 VDD IR5_Load P001 DR
R2 P001 !IR5_Loading 1k
R3 !IR5_Loading VSS 4.8k
J_A1 N001 !IR5_Loading 0 DR
R4 VDD N001 50k
J_A2 VDD N001 P002 DR
R5 P002 IR5_Loading 1k
R6 IR5_Loading VSS 4.5k
R7 VDD IR5_Out 100k
J_F2 VDD IR5_Out P003 DR
R8 P003 N003 1k
R9 N003 VSS 4.8k
J_A3 N002 N003 0 DR
R10 VDD N002 50k
J_A4 VDD N002 P004 DR
R11 P004 IR5_Outing 1k
R12 IR5_Outing VSS 4.5k
J_A5 N004 N005 P005 DR
R13 VDD N004 100k
J_F3 VDD N004 P006 DR
R14 P006 IR5_3 1k
R15 IR5_3 VSS 4.8k
J_B1 N004 !IR5_3 0 DR
J_A6 N009 N008 P007 DR
R16 VDD N009 100k
J_F4 VDD N009 P008 DR
R17 P008 !IR5_3 1k
R18 !IR5_3 VSS 4.8k
J_B2 N009 IR5_3 0 DR
J_A7 P005 CLK 0 DR
J_A8 P007 CLK 0 DR
J_A9 N006 IR5_3 P009 DR
R19 VDD N006 100k
J_F5 VDD N006 P010 DR
R20 P010 N005 1k
R21 N005 VSS 4.8k
J_B3 N006 Bus_3 P011 DR
J_A10 N007 N005 0 DR
R22 VDD N007 50k
J_A11 VDD N007 P012 DR
R23 P012 N008 1k
R24 N008 VSS 4.5k
J_A12 P009 !IR5_Loading 0 DR
J_B4 P011 IR5_Loading 0 DR
J_A13 N010 N011 P013 DR
R25 VDD N010 100k
J_F6 VDD N010 P014 DR
R26 P014 IR5_2 1k
R27 IR5_2 VSS 4.8k
J_B5 N010 !IR5_2 0 DR
J_A14 N015 N014 P015 DR
R28 VDD N015 100k
J_F7 VDD N015 P016 DR
R29 P016 !IR5_2 1k
R30 !IR5_2 VSS 4.8k
J_B6 N015 IR5_2 0 DR
J_A15 P013 CLK 0 DR
J_A16 P015 CLK 0 DR
J_A17 N012 IR5_2 P017 DR
R31 VDD N012 100k
J_F8 VDD N012 P018 DR
R32 P018 N011 1k
R33 N011 VSS 4.8k
J_B7 N012 Bus_2 P019 DR
J_A18 N013 N011 0 DR
R34 VDD N013 50k
J_A19 VDD N013 P020 DR
R35 P020 N014 1k
R36 N014 VSS 4.5k
J_A20 P017 !IR5_Loading 0 DR
J_B8 P019 IR5_Loading 0 DR
J_A21 N016 N017 P021 DR
R37 VDD N016 100k
J_F9 VDD N016 P022 DR
R38 P022 IR5_1 1k
R39 IR5_1 VSS 4.8k
J_B9 N016 !IR5_1 0 DR
J_A22 N021 N020 P023 DR
R40 VDD N021 100k
J_F10 VDD N021 P024 DR
R41 P024 !IR5_1 1k
R42 !IR5_1 VSS 4.8k
J_B10 N021 IR5_1 0 DR
J_A23 P021 CLK 0 DR
J_A24 P023 CLK 0 DR
J_A25 N018 IR5_1 P025 DR
R43 VDD N018 100k
J_F11 VDD N018 P026 DR
R44 P026 N017 1k
R45 N017 VSS 4.8k
J_B11 N018 Bus_1 P027 DR
J_A26 N019 N017 0 DR
R46 VDD N019 50k
J_A27 VDD N019 P028 DR
R47 P028 N020 1k
R48 N020 VSS 4.5k
J_A28 P025 !IR5_Loading 0 DR
J_B12 P027 IR5_Loading 0 DR
J_A29 N022 N023 P029 DR
R49 VDD N022 100k
J_F12 VDD N022 P030 DR
R50 P030 IR5_0 1k
R51 IR5_0 VSS 4.8k
J_B13 N022 !IR5_0 0 DR
J_A30 N027 N026 P031 DR
R52 VDD N027 100k
J_F13 VDD N027 P032 DR
R53 P032 !IR5_0 1k
R54 !IR5_0 VSS 4.8k
J_B14 N027 IR5_0 0 DR
J_A31 P029 CLK 0 DR
J_A32 P031 CLK 0 DR
J_A33 N024 IR5_0 P033 DR
R55 VDD N024 100k
J_F14 VDD N024 P034 DR
R56 P034 N023 1k
R57 N023 VSS 4.8k
J_B15 N024 Bus_0 P035 DR
J_A34 N025 N023 0 DR
R58 VDD N025 50k
J_A35 VDD N025 P036 DR
R59 P036 N026 1k
R60 N026 VSS 4.5k
J_A36 P033 !IR5_Loading 0 DR
J_B16 P035 IR5_Loading 0 DR
J_BUS1 P037 IR5_3 0 DR
J_BUS2 Bus3In IR5_Outing P037 DR
J_BUS3 P038 IR5_2 0 DR
J_BUS4 Bus2In IR5_Outing P038 DR
J_BUS5 P039 IR5_1 0 DR
J_BUS6 Bus1In IR5_Outing P039 DR
J_BUS7 P040 IR5_0 0 DR
J_BUS8 Bus0In IR5_Outing P040 DR
.model NJF NJF
.model PJF PJF
.lib standard.jft
.backanno
.end